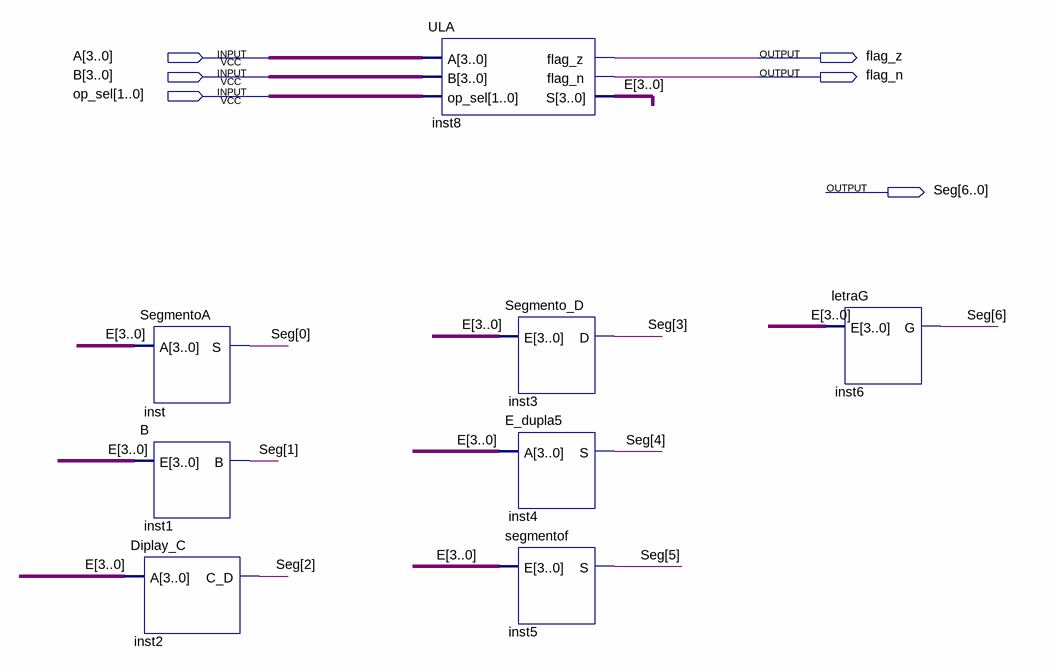
[diagram p0: schematic sheet]
// Quartus schematic Lab06.bdf as structural Verilog: 8 symbols, 6 pins
module Lab06 (
  input  [3:0] A,
  input  [3:0] B,
  input  [1:0] op_sel,
  output flag_z,
  output flag_n,
  output [6:0] Seg
);

  wire [3:0] E;

  Diplay_C inst2 (.A(E), .C_D(Seg[2]));
  SegmentoA inst (.A(E), .S(Seg[0]));
  B inst1 (.E(E), .B(Seg[1]));
  ULA inst8 (.A(A), .B(B), .op_sel(op_sel), .flag_z(flag_z), .flag_n(flag_n), .S(E));
  Segmento_D inst3 (.E(E), .D(Seg[3]));
  E_dupla5 inst4 (.A(E), .S(Seg[4]));
  segmentof inst5 (.E(E), .S(Seg[5]));
  letraG inst6 (.E(E), .G(Seg[6]));
endmodule
